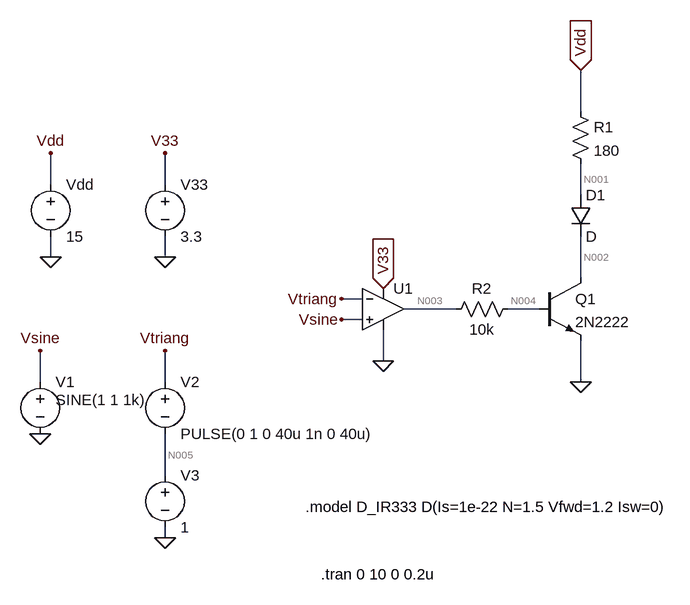
[diagram p0: schematic diseno1.asc]
diseno1.asc, the LTspice schematic file:
Version 4.1
SHEET 1 880 688
WIRE -96 -160 -96 -224
WIRE -912 -48 -912 -96
WIRE -736 -48 -736 -96
WIRE -96 -32 -96 -80
WIRE -912 64 -912 32
WIRE -736 64 -736 32
WIRE -96 96 -96 32
WIRE -432 128 -464 128
WIRE -288 144 -368 144
WIRE -160 144 -208 144
WIRE -432 160 -464 160
WIRE -400 224 -400 176
WIRE -928 256 -928 208
WIRE -736 256 -736 208
WIRE -96 256 -96 192
WIRE -736 400 -736 336
WIRE -736 496 -736 480
FLAG -736 64 0
FLAG -96 256 0
FLAG -736 -96 V33
FLAG -912 -96 Vdd
FLAG -912 64 0
FLAG -400 112 V33
IOPIN -400 112 In
FLAG -400 224 0
FLAG -96 -224 Vdd
IOPIN -96 -224 In
FLAG -928 336 0
FLAG -928 208 Vsine
FLAG -736 208 Vtriang
FLAG -464 128 Vtriang
FLAG -464 160 Vsine
FLAG -736 496 0
SYMBOL res -112 -176 R0
SYMATTR InstName R1
SYMATTR Value 180
SYMBOL res -192 128 R90
WINDOW 0 0 56 VBottom 2
WINDOW 3 32 56 VTop 2
SYMATTR InstName R2
SYMATTR Value 10k
SYMBOL voltage -912 -64 R0
WINDOW 123 0 0 Left 0
WINDOW 39 0 0 Left 0
SYMATTR InstName Vdd
SYMATTR Value 15
SYMBOL voltage -736 -64 R0
WINDOW 123 0 0 Left 0
WINDOW 39 0 0 Left 0
SYMATTR InstName V33
SYMATTR Value 3.3
SYMBOL npn -160 96 R0
SYMATTR InstName Q1
SYMATTR Value 2N2222
SYMBOL diode -112 -32 R0
SYMATTR InstName D1
SYMBOL voltage -928 240 R0
WINDOW 3 24 44 Left 2
WINDOW 123 0 0 Left 0
WINDOW 39 0 0 Left 0
SYMATTR Value SINE(1 1 1k)
SYMATTR InstName V1
SYMBOL voltage -736 240 R0
WINDOW 123 0 0 Left 0
WINDOW 39 0 0 Left 0
SYMATTR InstName V2
SYMATTR Value PULSE(0 1 0 40u 1n 0 40u)
SYMBOL OpAmps\\UniversalOpAmp2 -400 144 R0
SYMATTR InstName U1
SYMATTR Value2 Avol=1G GBW=1G Slew=1G
SYMBOL voltage -736 384 R0
WINDOW 123 0 0 Left 0
WINDOW 39 0 0 Left 0
SYMATTR InstName V3
SYMATTR Value 1
TEXT -520 448 Left 2 !.model D_IR333 D(Is=1e-22 N=1.5 Vfwd=1.2 Isw=0)
TEXT -496 552 Left 2 !.tran 0 10 0 0.2u

The netlist it stands for:
* diseno1.asc
R1 Vdd N001 180
R2 N004 N003 10k
Vdd Vdd 0 15
V33 V33 0 3.3
Q1 N002 N004 0 0 2N2222
D1 N001 N002 D
V1 Vsine 0 SINE(1 1 1k)
V2 Vtriang N005 PULSE(0 1 0 40u 1n 0 40u)
X§U1 Vsine Vtriang V33 0 N003 level2 Avol=1G GBW=1G Slew=1G Ilimit=25m Rail=0 Vos=0 En=0 Enk=0 In=0 Ink=0 Rin=500Meg  ; pins In+ In- V+ V- OUT
V3 N005 0 1
.model D D
.lib standard.dio
.model NPN NPN
.model PNP PNP
.lib standard.bjt
.model D_IR333 D(Is=1e-22 N=1.5 Vfwd=1.2 Isw=0)
.tran 0 10 0 0.2u
.lib UniversalOpAmp2.lib
.backanno
.end

* Results of the author's LTspice run, read from the files saved beside the schematic
* Operating Point, zero values left out:
*   V(n001) = 11.59 V
*   V(n002) = 10.86 V
*   V(n003) = 1.644 V
*   V(n004) = 734.8 mV
*   V(n005) = 1 V
*   V(v33) = 3.3 V
*   V(vdd) = 15 V
*   V(vsine) = 1 V
*   V(vtriang) = 1 V
*   I(D1) = 18.93 mA
*   I(R1) = 18.93 mA
*   I(R2) = -90.89 µA
*   I(V1) = 1.3 nA
*   I(V2) = 1.3 nA
*   I(V3) = 1.3 nA
*   I(V33) = -216.6 µA
*   I(Vdd) = -18.93 mA
*   Ib(Q1) = 90.89 µA
*   Ic(Q1) = 18.93 mA
*   Ie(Q1) = -19.02 mA
*   Ix(u1:1) = -1.3 nA
*   Ix(u1:2) = -1.3 nA
*   Ix(u1:3) = 216.6 µA
*   Ix(u1:4) = -125.7 µA
*   Ix(u1:5) = -90.89 µA